# EAGLE design 11_ESP (EAGLE 7.6.0)
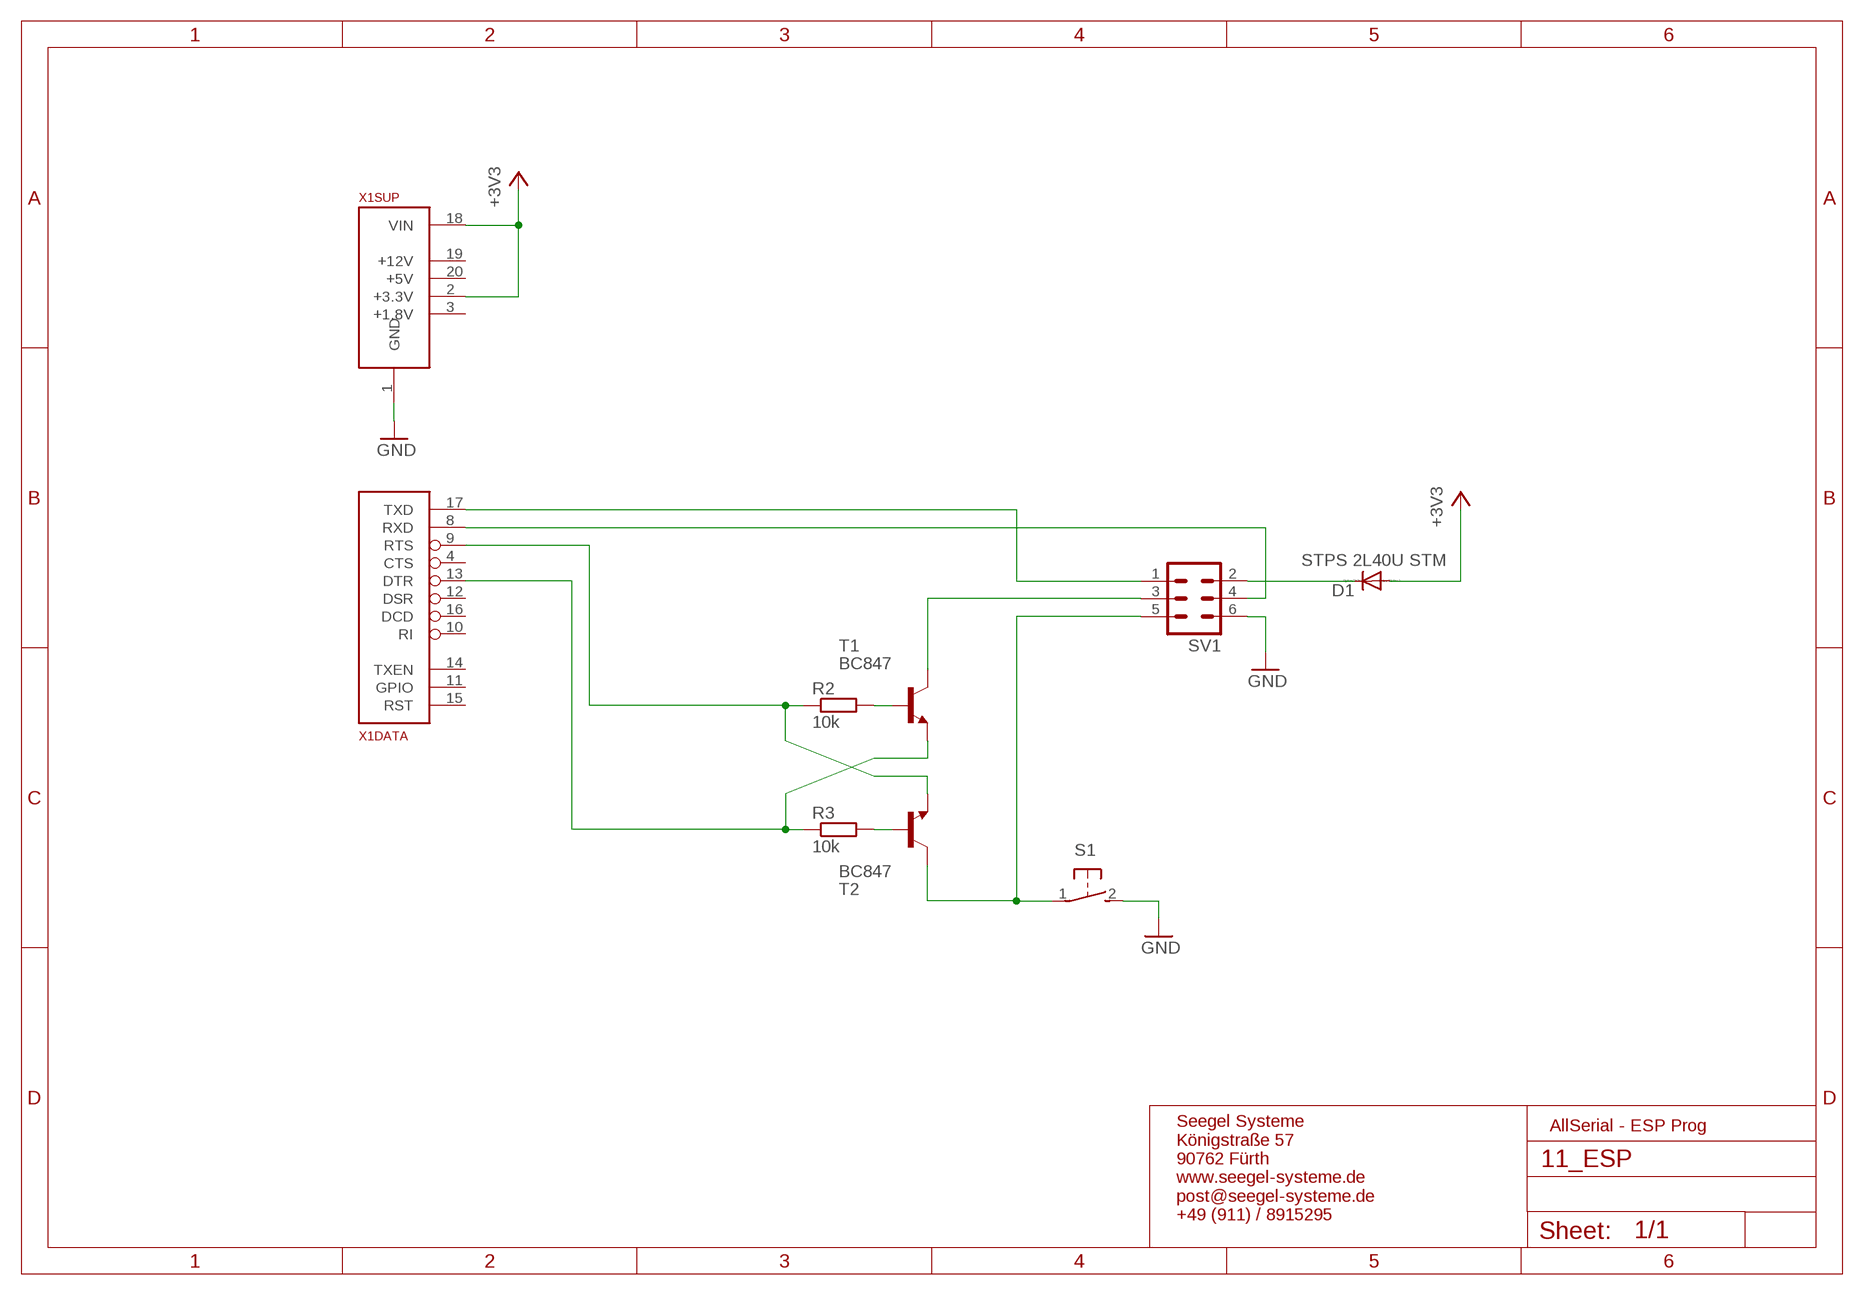
[diagram p0: schematic, sheet 1]

## Parts
D1  STPS 2L40U STM  DIODE-DO214AA  [DO214AA]
R2  10k  R-EU_R0805  [R0805]
R3  10k  R-EU_R0805  [R0805]
S1  31-XX  [B3F-31XX]
SV1  ML6L  [ML6L]
T1  BC847  [SOT23]
T2  BC847  [SOT23]
X1  ALLSERIALSLAVE  [DAUGHTER-THT]

## Nets
+3V3: D1.A X1.2(SUP:+3.3V) X1.18(SUP:VIN)
GND: S1.2(S) SV1.6 X1.1(SUP:GND)
N$1: D1.C SV1.2
N$2: R3.1 T1.2(E) X1.13(DATA:DTR)
N$3: SV1.3 T1.3(C)
N$4: S1.1(P) SV1.5 T2.3(C)
N$5: R2.1 T2.2(E) X1.9(DATA:RTS)
N$6: SV1.1 X1.17(DATA:TXD)
N$7: R2.2 T1.1(B)
N$8: R3.2 T2.1(B)
N$9: SV1.4 X1.8(DATA:RXD)
Unconnected: X1.3(SUP:+1.8V) X1.4(DATA:CTS) X1.5(USB:D-) X1.6(USB:D+) X1.7(USB:VUSB) X1.10(DATA:RI) X1.11(DATA:GPIO) X1.12(DATA:DSR) X1.14(DATA:TXEN) X1.15(DATA:RST) X1.16(DATA:DCD) X1.19(SUP:+12V) X1.20(SUP:+5V)

## Notes on the sheet
- AllSerial - ESP Prog
- Seegel Systeme
  Königstraße 57
  90762 Fürth
  www.seegel-systeme.de
  post@seegel-systeme.de
  +49 (911) / 8915295

## Library data of the parts
D1 = diode:DIODE-: DIODE
R2 R3 = rcl:R-EU_: RESISTOR, European symbol
S1 = switch-omron:31-XX: OMRON SWITCH; MPN: B3F-3100; OC_FARNELL: 959704; OC_NEWARK: 36M3582
SV1 = con-ml:ML6L: HARTING; OC_FARNELL: unknown; OC_NEWARK: unknown
T1 T2 = transistor:BC847: NPN TRANSISTOR
X1 = AllSerialv2:ALLSERIALSLAVE

## Board
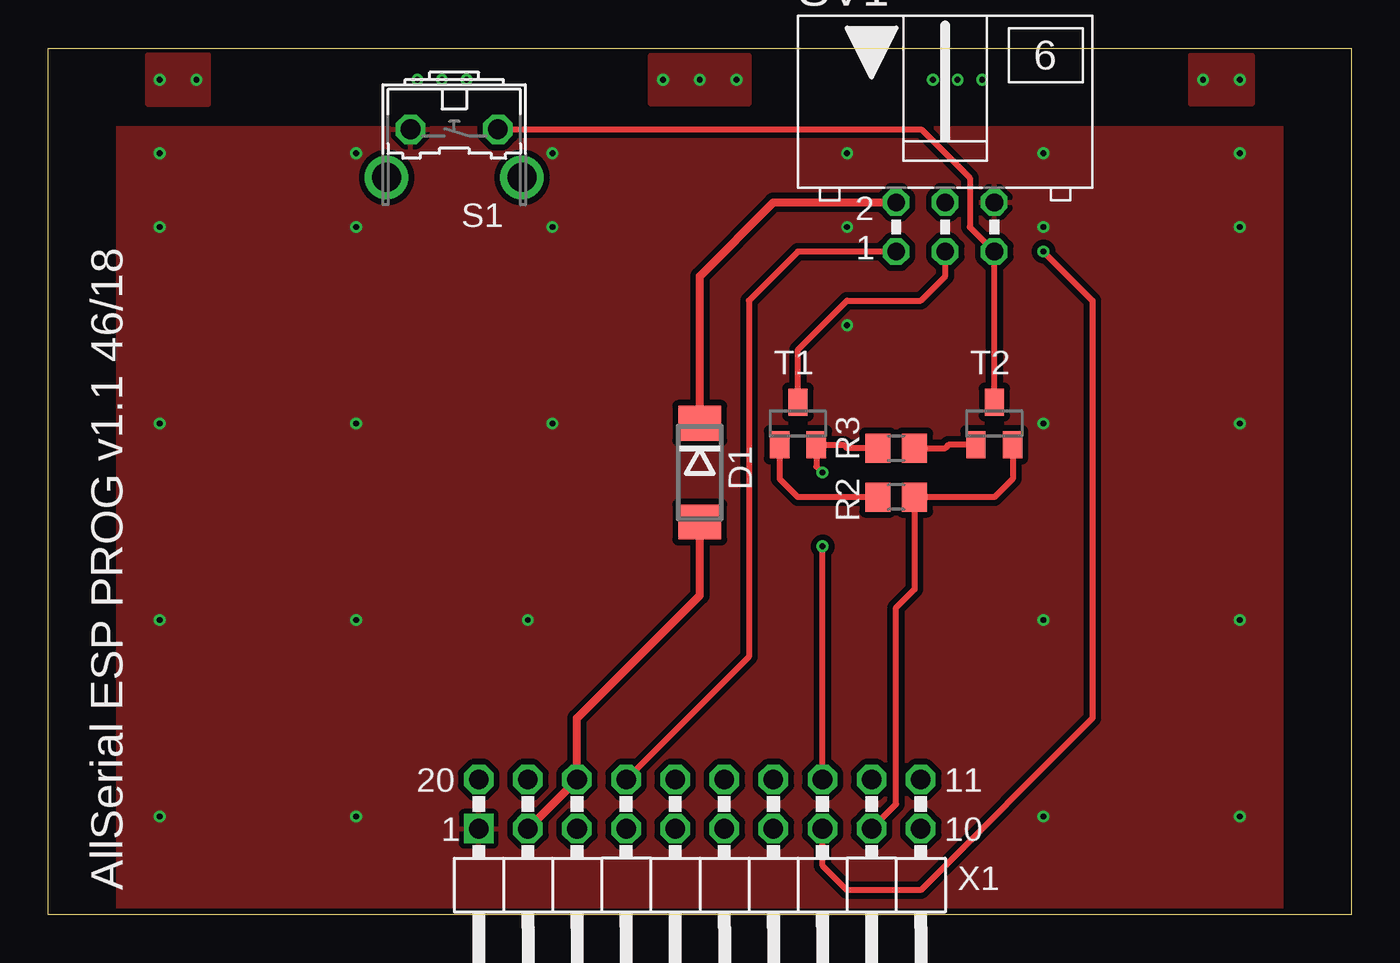
[diagram p1: board, top side]
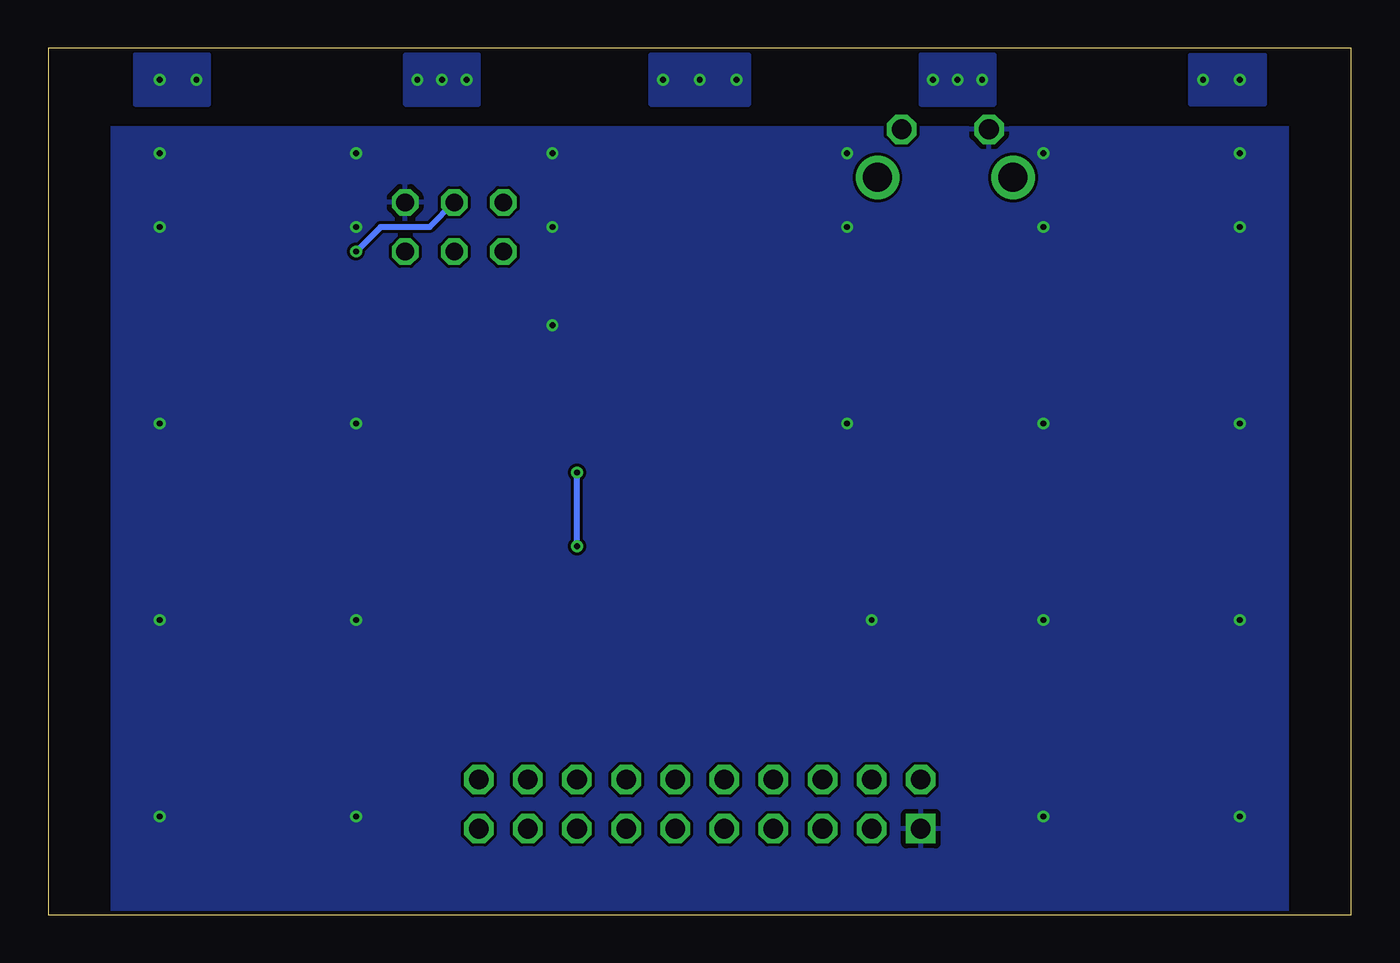
[diagram p2: board, bottom side, seen from below]

Size 67.4 x 44.8 mm. Coordinates in mm from the lower left corner, seen from the top.
Copper layers (1*16): Top 0.035mm / dielectric 1.6mm / Bottom 0.035mm
Design rules "Elecrow_2-layer_PCB_eagle_rule *": minimum track width 6mil, minimum drill 0.3mm, track to track 6mil, track to pad 6mil, pad to pad 6mil, via to via 8mil, smd to smd 0mil, copper to edge 0.2mm, drill to drill 10mil, minimum pad ring 6mil, minimum via ring 6mil, stop-mask expansion 0mil, vias tented up to drill 0.3mm, thermal gap 10mil

### Footprints (pad centres in the part's own frame; a part is rotated, then mirrored left to right if it is on the bottom)
DO214AA = smd 1.8 x 2.2: A 2.55,0; C -2.55,0
R0805 = smd 1.3 x 1.5: 1 -0.95,0; 2 0.95,0
B3F-31XX = drill 1.016 octagon: 1 -2.261,-1.245; 2 2.261,-1.245 | drill 1.499 pad 2.159: 3 -3.505,1.245; 4 3.505,1.245
ML6L = drill 0.914 octagon: 1 -2.54,-1.27; 2 -2.54,1.27; 3 0,-1.27; 4 0,1.27; 5 2.54,-1.27; 6 2.54,1.27
SOT23 = smd 1 x 1.4: 1 -0.95,-1.1; 2 0.95,-1.1; 3 0,1.1
DAUGHTER-THT = drill 1.016 square: 1 -11.43,4.445 | drill 1.016 octagon: 2 -8.89,4.445; 3 -6.35,4.445; 4 -3.81,4.445; 5 -1.27,4.445; 6 1.27,4.445; 7 3.81,4.445; 8 6.35,4.445; 9 8.89,4.445; 10 11.43,4.445; 11 11.43,6.985; 12 8.89,6.985; 13 6.35,6.985; 14 3.81,6.985; 15 1.27,6.985; 16 -1.27,6.985; 17 -3.81,6.985; 18 -6.35,6.985; 19 -8.89,6.985; 20 -11.43,6.985

### Placement (x,y rotation side)
D1  33.7,22.86 270 top
R2  43.86,21.59 180 top
R3  43.86,24.13 0 top
S1  21,39.37 180 top
SV1  46.4,35.56 0 top
T1  38.78,25.4 0 top
T2  48.94,25.4 0 top
X1  33.7,0 0 top

### Tracks (layer width: path | path; a pad name or v marks a point on that pad's centre or on a via)
+3V3
  Top 0.406: X1.2 X1.18 27.35,10.16 33.7,16.51 D1.A
GND  (via drill 0.3)
  other vias: 26.08,39.37 15.92,39.37 5.76,39.37 5.76,35.56 15.92,35.56 26.08,35.56 5.76,25.4 15.92,25.4 15.92,15.24 5.76,15.24 5.76,5.08 15.92,5.08 26.08,25.4 24.81,15.24 41.32,30.48 41.32,35.56 41.32,39.37 51.48,39.37 51.48,35.56 61.64,39.37 61.64,35.56 51.48,25.4 61.64,25.4 61.64,15.24 51.48,15.24 51.48,5.08 61.64,5.08
  pour Bottom: -0.59,40.64 67.99,40.64 67.99,0 -0.59,0
  pour Top (isolate 0.305): -0.59,0 67.99,0 67.99,40.64 -0.59,40.64
N$1
  Top 0.406: D1.C 33.7,33.02 37.51,36.83 SV1.2
N$2  (via drill 0.3)
  Top 0.305: R3.1 41.32,24.13 41.15,24.3 T1.2 39.73,23.18 v40.05,22.86 | X1.13 v40.05,19.05
  Bottom 0.305: v40.05,19.05 v40.05,22.86
N$3
  Top 0.305: T1.3 38.78,29.21 41.32,31.75 45.13,31.75 46.4,33.02 SV1.3
N$4
  Top 0.305: T2.3 SV1.5 47.67,35.56 47.67,38.1 45.16,40.62 S1.1
N$5
  Top 0.305: T2.2 49.89,22.54 48.94,21.59 R2.1 44.81,16.82 43.86,15.88 43.86,5.71 X1.9
N$6
  Top 0.305: SV1.1 38.78,34.29 36.24,31.75 36.24,13.34 X1.17
N$7
  Top 0.305: T1.1 37.83,22.54 38.78,21.59 R2.2
N$8
  Top 0.305: R3.2 46.4,24.13 46.57,24.3 T2.1
N$9  (via drill 0.3)
  Top 0.305: v51.48,34.29 54.02,31.75 54.02,10.16 45.13,1.27 41.32,1.27 40.05,2.54 X1.8
  Bottom 0.305: SV1.4 47.67,35.56 50.21,35.56 v51.48,34.29
N$10  (via drill 0.3)
  other vias: 20.37,43.18 19.1,43.18 21.64,43.18
  pour Bottom: 18.46,44.45 22.27,44.45 22.27,41.91 18.46,41.91
N$11  (via drill 0.3)
  other vias: 47.04,43.18 45.77,43.18 48.31,43.18
  pour Bottom: 45.13,44.45 48.94,44.45 48.94,41.91 45.13,41.91
N$13  (via drill 0.3)
  other vias: 7.67,43.18 5.76,43.18
  pour Bottom: 8.3,44.45 4.49,44.45 4.49,41.91 8.3,41.91
  pour Top: 8.3,44.45 5.13,44.45 5.13,41.91 8.3,41.91
N$14  (via drill 0.3)
  other vias: 33.7,43.18 31.8,43.18 35.61,43.18
  pour Bottom: 31.16,44.45 36.24,44.45 36.24,41.91 31.16,41.91
  pour Top: 31.16,44.45 36.24,44.45 36.24,41.91 31.16,41.91
N$15  (via drill 0.3)
  other vias: 59.73,43.18 61.64,43.18
  pour Bottom: 59.1,44.45 62.91,44.45 62.91,41.91 59.1,41.91
  pour Top: 59.1,44.45 62.28,44.45 62.28,41.91 59.1,41.91

### Text on the board
tPlace: AllSerial ESP PROG v1.1 46/18